# Altium schematic sheet VCSEL.SchDoc
size A4
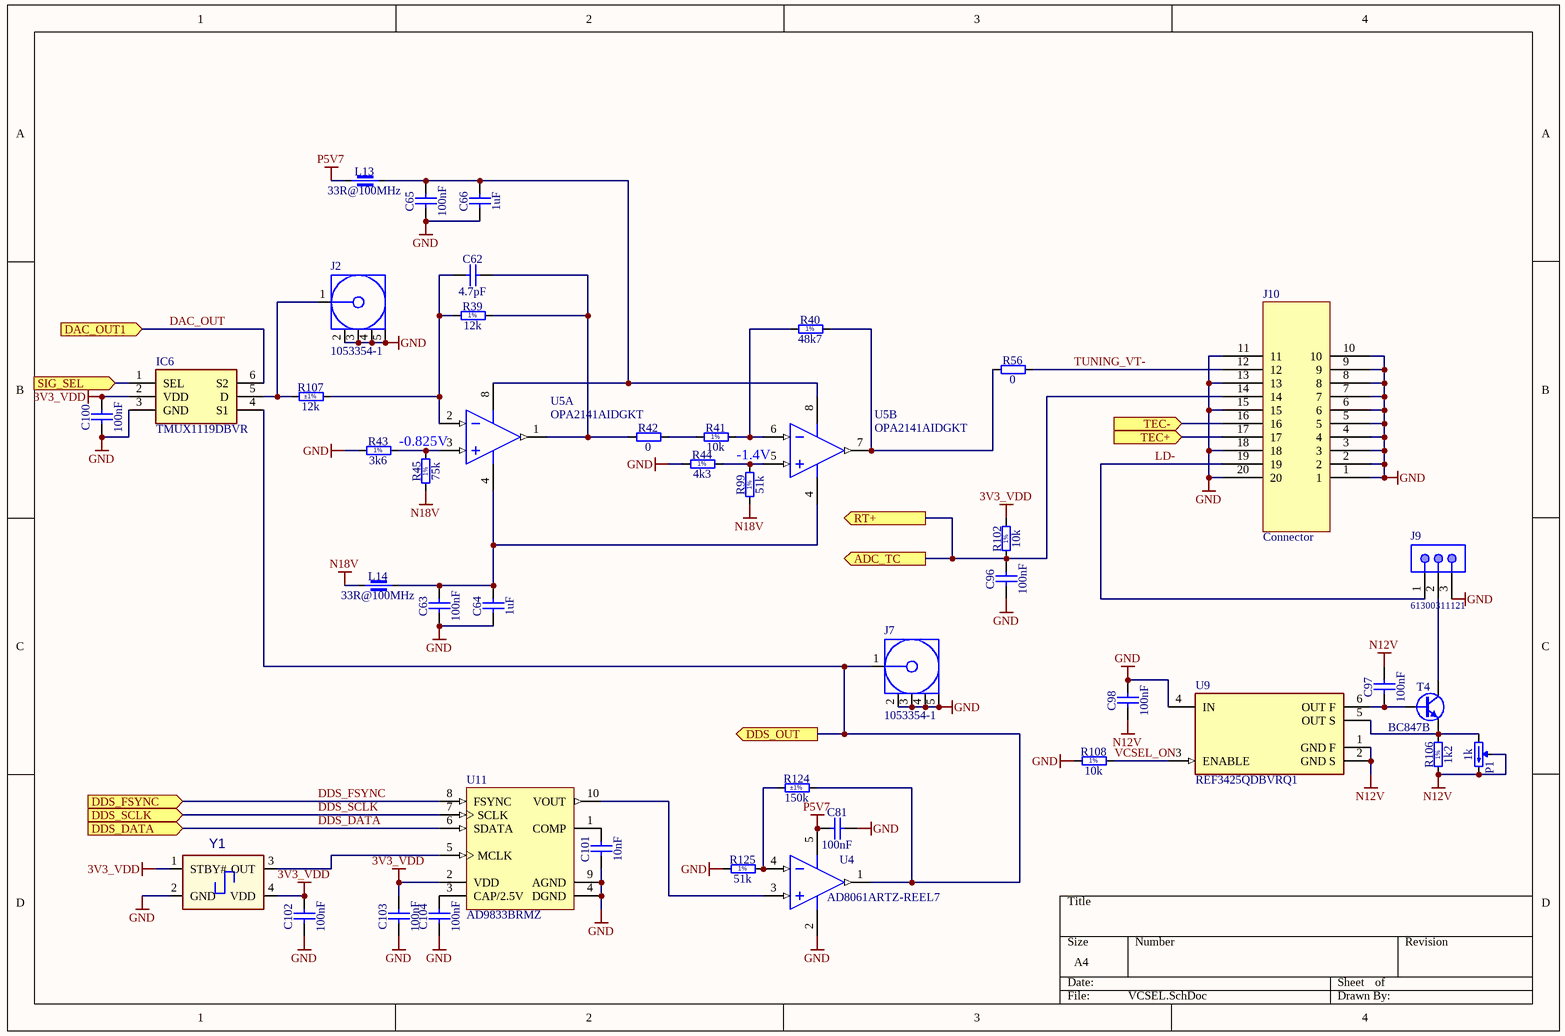
[diagram p0: VCSEL.SchDoc]

## Parts
C62  4.7pF  [CAPC1005X70N]
C63  100nF  [CAPC1608X87N]
C64  1uF  [CAPC1608X87N]
C65  100nF  [CAPC1005X55N]
C66  1uF  [CAPC1005X55N]
C81  100nF  [CAPC1005X55N]
C96  100nF  [CAPC1005X55N]
C97  100nF  [CAPC1005X55N]
C98  100nF  [CAPC1005X55N]
C100  100nF  [CAPC1005X55N]
C101  10nF  [CAPC1005X55N]
C102  100nF  [CAPC1005X55N]
C103  100nF  [CAPC1005X55N]
C104  100nF  [CAPC1005X55N]
IC6  TMUX1119DBVR  [SOT95P280X145-6N]
J2  1053354-1  [TECO-1053354-1_V]
J7  1053354-1  [TECO-1053354-1_V]
J9  61300311121  [61300311121]
J10  Connector  [VCSEL_CONNECTOR]
L13  33R@100MHz  [INDC1005X55N]
L14  33R@100MHz  [INDC1005X55N]
P1  1k  [TRIM_BOURNS_3266W]
R39  12k  [RESC1005X40N]
R40  48k7  [RESC1608X55N]
R41  10k  [RESC1005X40N]
R42  0  [RESC1005X40N]
R43  3k6  [RESC1005X40N]
R44  4k3  [RESC1005X40N]
R45  75k  [RESC1005X40N]
R56  0  [RESC1005X40N]
R99  51k  [RESC1005X40N]
R102  10k  [RESC1005X40N]
R106  1k2  [RESC1005X40N]
R107  12k  Tolerance: ±1%  [RESC1005X40N]
R108  10k  [RESC1005X40N]
R124  150k  Tolerance: ±1%  [RESC1005X40N]
R125  51k  [RESC1005X40N]
T4  BC847B  [SOT95P230X110-3N]
U4  AD8061ARTZ-REEL7  [ADI-RJ-5_L]
U5  OPA2141AIDGKT  [DGK0008A_M]  (parts A,B of 2)
U9  REF3425QDBVRQ1  [FP-DBV0006A-MFG]
U11  AD9833BRMZ  [ADI-RM-10_M]
Y1  OSCILLATOR_4P_nSTBY  [OSCILLATOR_CDFN_L2.5W2.0H0.85]  (value not drawn)

## Ports
ADC_TC (out), DAC_OUT1 (in), DDS_DATA (in), DDS_FSYNC (in), DDS_OUT (out), DDS_SCLK (in), RT+ (out), SIG_SEL (in), TEC+ (in), TEC- (in)

## Nets
3V3_VDD: C100.2 C102.2 C103.2 IC6.2(VDD) R102.2 U11.2(VDD) Y1.1(STBY#) Y1.4(VDD)
GND: C63.1 C64.1 C65.1 C66.1 C81.2 C96.1 C98.2 C100.1 C101.1 C102.1 C103.1 C104.1 IC6.3(GND) J2.2 J2.3 J2.4 J2.5 J7.2 J7.3 J7.4 J7.5 J9.3 J10.1 J10.2 J10.3 J10.4 J10.5 J10.6 J10.7 J10.8 J10.9 J10.10 J10.11 J10.13 J10.15 J10.18 J10.20 R43.1 R44.1 R108.1 R125.1 U4.2(-VS) U9.4(IN) U11.4(DGND) U11.9(AGND) Y1.2(GND)
N12V: C97.2 C98.1 P1.2(W) P1.3(CW) R106.1 U9.1(GND_F) U9.2(GND_S)
N18V: L14.1 R45.1 R99.1
P5V7: C81.1 L13.1 U4.5(+VS)
ADC_TC: C96.2 J10.14 R102.1 ; port ADC_TC, port RT+
DAC_OUT: IC6.6(S2) ; port DAC_OUT1
DDS_DATA: U11.6(SDATA) ; port DDS_DATA
DDS_FSYNC: U11.8(FSYNC) ; port DDS_FSYNC
DDS_OUT: IC6.4(S1) J7.1 R124.2 U4.1(VOUT) ; port DDS_OUT
DDS_SCLK: U11.7(SCLK) ; port DDS_SCLK
LD-: J9.1 J10.19
SIG_SEL: IC6.1(SEL) ; port SIG_SEL
TEC+: J10.17 ; port TEC+
TEC-: J10.16 ; port TEC-
TUNING_VT-: J10.12 R56.2
VCSEL_ON: R108.2 U9.3(ENABLE)
NetC62_1: C62.1 R39.1 R107.2 U5.2(IN_A-)
NetC62_2: C62.2 R39.2 R42.1 U5.1(OUT_A)
NetC63_2: C63.2 C64.2 L14.2 U5.4(V-)
NetC65_2: C65.2 C66.2 L13.2 U5.8(V+)
NetC97_1: C97.1 T4.1(B) U9.6(OUT_F)
NetC101_2: C101.2 U11.1(COMP)
NetC104_2: C104.2 U11.3(CAP/2.5V)
NetIC6_5: IC6.5(D) J2.1 R107.1
NetJ9_2: J9.2 T4.3(C)
NetP1_1: P1.1(CCW) R106.2 T4.2(E) U9.5(OUT_S)
NetR40_1: R40.1 R41.2 U5.6(IN_B-)
NetR40_2: R40.2 R56.1 U5.7(OUT_B)
NetR41_1: R41.1 R42.2
NetR43_2: R43.2 R45.2 U5.3(IN_A+)
NetR44_2: R44.2 R99.2 U5.5(IN_B+)
NetR124_1: R124.1 R125.2 U4.4(-IN)
NetU4_3: U4.3(+IN) U11.10(VOUT)
NetU11_5: U11.5(MCLK) Y1.3(OUT)

## Notes on the sheet
- -0.825V
- -1.4V
- (in symbol R0402_1K2_1%_0.0625W_100PPM) 1%
- (in symbol R0402_3K6_1%_0.0625W_100PPM) 1%
- (in symbol R0402_4K3_1%_0.0625W_100PPM) 1%
- (in symbol R0402_10K_1%_0.0625W_100PPM) 1%
- (in symbol R0402_12K_1%_0.0625W_100PPM) 1%
- (in symbol R0402_51K_1%_0.0625W_100PPM) 1%
- (in symbol R0402_75K_1%_0.0625W_100PPM) 1%
- (in symbol R0603_48K7_1%_0.1W_100PPM) 1%

## Library data of the parts
C62 = CC0402_4.7PF_50V_0.25PF_C0G_VISHAY_VJ_NON-MAGNETIC: Non-polarised capacitor; Part Description: Surface Mount Multilayer Ceramic Chip Capacitors for Non-Magnetic Applications (IR Reflow Soldering); Manufacturer: VISHAY VITRAMON; Manufacturer Part Number: VJ0402A4R7CCAA; Voltage: 50V; TC: C0G/NP0; Tolerance: ±0.25pF; Part Number: CC0402_4.7PF_50V_0.25PF_C0G_VISHAY_VJ_NON-MAGNETIC; Component Kind: Standard; Component Type: Standard; Pin Count: 2; Value: 4.7pF; Status: Not Recommended; Case: 0402; Mounted: Yes; Socket: No; SMD: Yes; Sense: No; ComponentHeight: 0.64mm; HelpURL: \\cern.ch\dfs\Applications\Altium\Datasheets\CC0402_VISHAY_VJ_NON-MAGNETIC.pdf; Author: CERN DEM MR; CreateDate: 03.03.2017; LatestRevisionDate: 03.03.2017
C63 = CC0603_100NF_50V_10%_X5R: Non-polarised capacitor; Part Description: SMD Multilayer Chip Ceramic Capacitor; Manufacturer: GENERIC; Manufacturer1 Part Number: C1608X5R1H104K080; Voltage: 50V; TC: X5R; Tolerance: ±10%; Part Number: CC0603_100NF_50V_10%_X5R; Component Kind: Standard; Component Type: Standard; Pin Count: 2; Value: 100nF; Status: None; Manufacturer Part Number: CC0603_100NF_50V_10%_X5R; Case: 0603; Mounted: Yes; Socket: No; SMD: Yes; Sense: No; Manufacturer1 Example: TDK; Manufacturer1 ComponentHeight: 0.9mm; HelpURL: \\cern.ch\dfs\Applications\Altium\Datasheets\CC0603_X5R_TDK_C.pdf; Author: CERN DEM MR; CreateDate: 08.01.2016; LatestRevisionDate: 08.01.2016
C64 = CC0603_1UF_25V_10%_X7R: Non-polarised capacitor; Part Description: SMD Multilayer Chip Ceramic Capacitor; Manufacturer: GENERIC; Manufacturer1 Part Number: GRM188R71E105KA12D; Voltage: 25V; TC: X7R; Tolerance: ±10%; Part Number: CC0603_1UF_25V_10%_X7R; Component Kind: Standard; Component Type: Standard; Pin Count: 2; Value: 1uF; Status: None; Manufacturer Part Number: CC0603_1UF_25V_10%_X7R; Case: 0603; Mounted: Yes; Socket: No; SMD: Yes; Sense: No; Manufacturer1 Example: MURATA; Manufacturer1 ComponentHeight: 0.9mm; HelpURL: \\cern.ch\dfs\Applications\Altium\Datasheets\CC0603_X7R_MURATA.pdf; Author: CERN DEM JLC; CreateDate: 18.01.2011; LatestRevisionDate: 18.01.2011
C65 C81 C96-C98 C100 C102-C104 = CC0402_100NF_16V_10%_X7R: Non-polarised capacitor; Part Description: SMD Multilayer Chip Ceramic Capacitor; Manufacturer: GENERIC; Manufacturer1 Part Number: GRM155R71C104KA88D; Voltage: 16V; TC: X7R; Tolerance: ±10%; Part Number: CC0402_100NF_16V_10%_X7R; Component Kind: Standard; Component Type: Standard; Pin Count: 2; Value: 100nF; Status: Not Recommended; Manufacturer Part Number: CC0402_100NF_16V_10%_X7R; Case: 0402; Mounted: Yes; Socket: No; SMD: Yes; Sense: No; Manufacturer1 Example: MURATA; Manufacturer1 ComponentHeight: 0.55mm; HelpURL: \\cern.ch\dfs\Applications\Altium\Datasheets\CC0402_X7R_MURATA_GRM.pdf; Author: CERN DEM JLC; CreateDate: 05.12.2013; LatestRevisionDate: 03.12.2007
C66 = CC0402_1UF_16V_10%_X5R: Non-polarised capacitor; Part Description: SMD Multilayer Chip Ceramic Capacitor; Manufacturer: GENERIC; Manufacturer1 Part Number: C1005X5R1C105KT; Voltage: 16V; TC: X5R; Tolerance: ±10%; Part Number: CC0402_1UF_16V_10%_X5R; Component Kind: Standard; Component Type: Standard; Pin Count: 2; Value: 1uF; Status: Preferred; Manufacturer Part Number: CC0402_1UF_16V_10%_X5R; Case: 0402; Mounted: Yes; Socket: No; SMD: Yes; Sense: No; Manufacturer1 Example: TDK; Manufacturer1 ComponentHeight: 0.55mm; HelpURL: \\cern.ch\dfs\Applications\Altium\Datasheets\CC0402_X5R_TDK_C.pdf; Author: CERN DEM JLC; CreateDate: 25.10.2012; LatestRevisionDate: 25.10.2012
C101 = CC0402_10NF_16V_10%_X7R: Non-polarised capacitor; Part Description: SMD Multilayer Chip Ceramic Capacitor; Manufacturer: GENERIC; Manufacturer1 Part Number: 223878715636; Voltage: 16V; TC: X7R; Tolerance: ±10%; Part Number: CC0402_10NF_16V_10%_X7R; Component Kind: Standard; Component Type: Standard; Pin Count: 2; Value: 10nF; Status: Not Recommended; Manufacturer Part Number: CC0402_10NF_16V_10%_X7R; Case: 0402; Mounted: Yes; Socket: No; SMD: Yes; Sense: No; Manufacturer1 Example: PHYCOMP; Manufacturer1 ComponentHeight: 0.55mm; HelpURL: \\cern.ch\dfs\Applications\Altium\Datasheets\CC0402_X7R_PHYCOMP.pdf; Author: CERN DEM JLC; CreateDate: 03.12.2007; LatestRevisionDate: 03.12.2007
IC6 = TMUX1119DBVR: Integrated Circuit; Manufacturer_Name: Texas Instruments; Datasheet Link: https://www.ti.com/lit/gpn/TMUX1119; Height: 1.45mm; Manufacturer_Part_Number: TMUX1119DBVR
J2 J7 = CMP-2000-05830-1: Female Coaxial Connector, Pitch 2.55 mm, Height 9.5 mm, Tail Length 3.9 mm, RoHS, Bulk; Manufacturer: TE Connectivity; Dynamic Catalog: SMA; Impedance: 50Ohm; Contact Termination: Solder; Connector Type: Jack,FemaleSockets; 3D Model: 1053354-1.pdf; Other Names: 2062000000 / A30046; Datasheet Version: Rev. B, 05/2011; Package Reference: 1053354-1; RoHS Information: 1053354-1StatementofCompliance; Series: SMA; Connector Style: SMA; Family: CoaxialConnectors(RF); Category: Connectors,Interconnects; Fastening Type: Threaded; Standard Package: 125; Mounting Type: ThroughHole; Packaging: Bulk; Datasheet URL: http://www.te.com/commerce/DocumentDelivery/DDEController?Action=srchrtrv&DocNm=1053354&DocType=Customer+Drawing&DocLang=English; Mounting Technology: ThroughHole; Manufacturer URL: http://www.te.com/; Package Description: Female Coaxial Connector, Pitch 2.55 mm, Height 9.5 mm, Tail Length 3.9 mm
J9 = 61300311121: WR-PHD Pin Header, THT, pitch 2.54mm, Single Row, Vertical, 3pin; Pin Number: 3; Gender: Male; Rated Current: 3A; Working Voltage: 250VAC; Withstanding Voltage: 500VAC; Contact Resistance: 20mOhm; ComponentLink1Description: Manufacturer; ComponentLink1URL: http://www.we-online.de; ComponentLink2Description: Datasheet; ComponentLink2URL: https://katalog.we-online.de/em/datasheet/6130xx11121.pdf; Part Number: 61300311121; Published Date: June 2019; Publisher: Wurth Elektronik; Pitch: 2.54mm; Operating Temperature: -40 to +105degC; Mounting Technology: THT; Packaging: Bag; Row Number: Single; Orientation: Vertical
J10 = VCSEL_CONNECTOR: VCSEL connector
L13 L14 = IND0402_MURATA_BLM15PX330SN1D: Part Description: SMD EMIFIL Chip Ferrite Bead; Manufacturer: MURATA; Power: 3A; Resistance: 0.022R; Tolerance: ±25%; Part Number: IND0402_MURATA_BLM15PX330SN1D; Component Kind: Standard; Component Type: Standard; Pin Count: 2; Value: 33R@100MHz; Status: None; Manufacturer Part Number: BLM15PX330SN1D; Case: 0402; Mounted: Yes; Socket: No; SMD: Yes; Sense: No; ComponentHeight: 0.55mm; HelpURL: \\cern.ch\dfs\Applications\Altium\Datasheets\IND0402_MURATA_BLM15PX.pdf; Author: CERN DEM JMW; CreateDate: 19.02.2014; LatestRevisionDate: 25.10.2018
P1 = TRIM_12T_1K_BOURNS_3266W-1-102LF: Trimming Potentiometer; Part Description: 12 Turn Trimming Potentiometer (Top Adjustment); Manufacturer: BOURNS; Power: 0.25W; TC: ±100ppm/°C; Tolerance: ±10%; PressFit: No; Part Number: TRIM_12T_1K_BOURNS_3266W-1-102LF; Component Kind: Standard; Component Type: Standard; Pin Count: 3; Value: 1k; Manufacturer Part Number: 3266W-1-102LF; Case: 3266W; Mounted: Yes; Socket: No; SMD: No; Sense: No; ComponentHeight: 7.75mm; HelpURL: \\cern.ch\dfs\Applications\Altium\Datasheets\TRIM_BOURNS_3266W.pdf; Author: CERN DEM JLC; CreateDate: 10.06.2008; LatestRevisionDate: 28.11.2012
R39 = R0402_12K_1%_0.0625W_100PPM: Resistor - 1%; Part Description: General Purpose Thick Film Chip Resistor; Manufacturer: GENERIC; Manufacturer1 Part Number: 232270671203L; TC: ±100ppm/°C; PressFit: No; Part Number: R0402_12K_1%_0.0625W_100PPM; Component Kind: Standard; Component Type: Standard; Pin Count: 2; Value: 12k; Status: Not Recommended; Power: 0.0625W; Tolerance: ±1%; Manufacturer Part Number: R0402_12K_1%_0.0625W_100PPM; Case: 0402; Mounted: Yes; Sense: No; Socket: No; SMD: Yes; Manufacturer1 Example: YAGEO PHYCOMP; Manufacturer1 ComponentHeight: 0.4mm; HelpURL: \\cern.ch\dfs\Applications\Altium\Datasheets\R0402_Phycomp_RC0402.pdf; Author: CERN DEM JLC; CreateDate: 03.12.2007; LatestRevisionDate: 17.10.2012
R40 = R0603_48K7_1%_0.1W_100PPM: Resistor - 1%; Part Description: General Purpose Thick Film Chip Resistor; Manufacturer: GENERIC; Manufacturer1 Part Number: CRCW060348K7FKEA; Power: 0.1W; TC: ±100ppm/°C; PressFit: No; Part Number: R0603_48K7_1%_0.1W_100PPM; Component Kind: Standard; Component Type: Standard; Pin Count: 2; Value: 48k7; Status: Preferred; Tolerance: ±1%; Manufacturer Part Number: R0603_48K7_1%_0.1W_100PPM; Case: 0603; Mounted: Yes; Sense: No; Socket: No; SMD: Yes; Manufacturer1 Example: VISHAY; Manufacturer1 ComponentHeight: 0.55mm; HelpURL: \\cern.ch\dfs\Applications\Altium\Datasheets\R0603_VISHAY_CRCW e3.pdf; Author: CERN DEM JLC; CreateDate: 15.07.2010; LatestRevisionDate: 11.12.2013
R41 R102 R108 = R0402_10K_1%_0.0625W_100PPM: Resistor - 1%; Part Description: General Purpose Thick Film Chip Resistor; Manufacturer: GENERIC; Manufacturer1 Part Number: 232270671003L; TC: ±100ppm/°C; PressFit: No; Part Number: R0402_10K_1%_0.0625W_100PPM; Component Kind: Standard; Component Type: Standard; Pin Count: 2; Value: 10k; Status: Not Recommended; Power: 0.0625W; Tolerance: ±1%; Manufacturer Part Number: R0402_10K_1%_0.0625W_100PPM; Case: 0402; Mounted: Yes; Sense: No; Socket: No; SMD: Yes; Manufacturer1 Example: YAGEO PHYCOMP; Manufacturer1 ComponentHeight: 0.4mm; HelpURL: \\cern.ch\dfs\Applications\Altium\Datasheets\R0402_Phycomp_RC0402.pdf; Author: CERN DEM JLC; CreateDate: 03.12.2007; LatestRevisionDate: 17.10.2012
R42 R56 = R0402_0R_JUMPER: Resistor; Part Description: 1A (0.05R Max DC Resistance) Zero Ohm Jumper; Manufacturer: GENERIC; Manufacturer1 Part Number: 232270591001L; PressFit: No; Part Number: R0402_0R_JUMPER; Component Kind: Standard; Component Type: Standard; Pin Count: 2; Value: 0; Status: Not Recommended; Manufacturer Part Number: R0402_0R_JUMPER; Case: 0402; Mounted: Yes; Sense: No; Socket: No; SMD: Yes; Manufacturer1 Example: YAGEO PHYCOMP; Manufacturer1 ComponentHeight: 0.4mm; HelpURL: \\cern.ch\dfs\Applications\Altium\Datasheets\R0402_Phycomp_RC0402.pdf; Author: CERN DEM JLC; CreateDate: 03.12.2007; LatestRevisionDate: 17.10.2012
R43 = R0402_3K6_1%_0.0625W_100PPM: Resistor - 1%; Part Description: General Purpose Thick Film Chip Resistor; Manufacturer: GENERIC; Manufacturer1 Part Number: 232270673602L; TC: ±100ppm/°C; PressFit: No; Part Number: R0402_3K6_1%_0.0625W_100PPM; Component Kind: Standard; Component Type: Standard; Pin Count: 2; Value: 3k6; Status: Not Recommended; Power: 0.0625W; Tolerance: ±1%; Manufacturer Part Number: R0402_3K6_1%_0.0625W_100PPM; Case: 0402; Mounted: Yes; Sense: No; Socket: No; SMD: Yes; Manufacturer1 Example: YAGEO PHYCOMP; Manufacturer1 ComponentHeight: 0.4mm; HelpURL: \\cern.ch\dfs\Applications\Altium\Datasheets\R0402_Phycomp_RC0402.pdf; Author: CERN DEM JLC; CreateDate: 03.12.2007; LatestRevisionDate: 17.10.2012
R44 = R0402_4K3_1%_0.0625W_100PPM: Resistor - 1%; Part Description: General Purpose Thick Film Chip Resistor; Manufacturer: GENERIC; Manufacturer1 Part Number: 232270674302L; TC: ±100ppm/°C; PressFit: No; Part Number: R0402_4K3_1%_0.0625W_100PPM; Component Kind: Standard; Component Type: Standard; Pin Count: 2; Value: 4k3; Status: Not Recommended; Power: 0.0625W; Tolerance: ±1%; Manufacturer Part Number: R0402_4K3_1%_0.0625W_100PPM; Case: 0402; Mounted: Yes; Sense: No; Socket: No; SMD: Yes; Manufacturer1 Example: YAGEO PHYCOMP; Manufacturer1 ComponentHeight: 0.4mm; HelpURL: \\cern.ch\dfs\Applications\Altium\Datasheets\R0402_Phycomp_RC0402.pdf; Author: CERN DEM JLC; CreateDate: 03.12.2007; LatestRevisionDate: 17.10.2012
R45 = R0402_75K_1%_0.0625W_100PPM: Resistor - 1%; Part Description: General Purpose Thick Film Chip Resistor; Manufacturer: GENERIC; Manufacturer1 Part Number: 232270677503L; TC: ±100ppm/°C; PressFit: No; Part Number: R0402_75K_1%_0.0625W_100PPM; Component Kind: Standard; Component Type: Standard; Pin Count: 2; Value: 75k; Status: Not Recommended; Power: 0.0625W; Tolerance: ±1%; Manufacturer Part Number: R0402_75K_1%_0.0625W_100PPM; Case: 0402; Mounted: Yes; Sense: No; Socket: No; SMD: Yes; Manufacturer1 Example: YAGEO PHYCOMP; Manufacturer1 ComponentHeight: 0.4mm; HelpURL: \\cern.ch\dfs\Applications\Altium\Datasheets\R0402_Phycomp_RC0402.pdf; Author: CERN DEM JLC; CreateDate: 03.12.2007; LatestRevisionDate: 17.10.2012
R99 R125 = R0402_51K_1%_0.0625W_100PPM: Resistor - 1%; Part Description: General Purpose Thick Film Chip Resistor; Manufacturer: GENERIC; Manufacturer1 Part Number: 232270674703L; TC: ±100ppm/°C; PressFit: No; Part Number: R0402_51K_1%_0.0625W_100PPM; Component Kind: Standard; Component Type: Standard; Pin Count: 2; Value: 51k; Status: Not Recommended; Power: 0.0625W; Tolerance: ±1%; Manufacturer Part Number: R0402_51K_1%_0.0625W_100PPM; Case: 0402; Mounted: Yes; Sense: No; Socket: No; SMD: Yes; Manufacturer1 Example: YAGEO PHYCOMP; Manufacturer1 ComponentHeight: 0.4mm; HelpURL: \\cern.ch\dfs\Applications\Altium\Datasheets\R0402_Phycomp_RC0402.pdf; Author: CERN DEM JLC; CreateDate: 03.12.2007; LatestRevisionDate: 17.10.2012
R106 = R0402_1K2_1%_0.0625W_100PPM: Resistor - 1%; Part Description: General Purpose Thick Film Chip Resistor; Manufacturer: GENERIC; Manufacturer1 Part Number: 232270671202L; TC: ±100ppm/°C; PressFit: No; Part Number: R0402_1K2_1%_0.0625W_100PPM; Component Kind: Standard; Component Type: Standard; Pin Count: 2; Value: 1k2; Status: Not Recommended; Power: 0.0625W; Tolerance: ±1%; Manufacturer Part Number: R0402_1K2_1%_0.0625W_100PPM; Case: 0402; Mounted: Yes; Sense: No; Socket: No; SMD: Yes; Manufacturer1 Example: YAGEO PHYCOMP; Manufacturer1 ComponentHeight: 0.4mm; HelpURL: \\cern.ch\dfs\Applications\Altium\Datasheets\R0402_Phycomp_RC0402.pdf; Author: CERN DEM JLC; CreateDate: 03.12.2007; LatestRevisionDate: 17.10.2012
R107 = R0402_12K_1%_0.0625W_100PPM: Resistor - 1%; Part Description: General Purpose Thick Film Chip Resistor; Manufacturer: GENERIC; Manufacturer1 Part Number: 232270671203L; PressFit: No; TC: ±100ppm/°C; Part Number: R0402_12K_1%_0.0625W_100PPM; Component Kind: Standard; Component Type: Standard; Pin Count: 2; Value: 12k; Status: Not Recommended; Manufacturer Part Number: R0402_12K_1%_0.0625W_100PPM; Case: 0402; Mounted: Yes; Sense: No; Socket: No; SMD: Yes; Manufacturer1 Example: YAGEO PHYCOMP; Manufacturer1 ComponentHeight: 0.4mm; HelpURL: \\cern.ch\dfs\Applications\Altium\Datasheets\R0402_Phycomp_RC0402.pdf; Author: CERN DEM JLC; CreateDate: 03.12.2007; LatestRevisionDate: 17.10.2012; Power: 0.0625W
R124 = R0402_150K_1%_0.0625W_100PPM: Resistor - 1%; Part Description: General Purpose Thick Film Chip Resistor; Manufacturer: GENERIC; Manufacturer1 Part Number: 232270671504L; TC: ±100ppm/°C; PressFit: No; Part Number: R0402_150K_1%_0.0625W_100PPM; Component Kind: Standard; Component Type: Standard; Pin Count: 2; Value: 150k; Status: Not Recommended; Power: 0.0625W; Manufacturer Part Number: R0402_150K_1%_0.0625W_100PPM; Case: 0402; Mounted: Yes; Sense: No; Socket: No; SMD: Yes; Manufacturer1 Example: YAGEO PHYCOMP; Manufacturer1 ComponentHeight: 0.4mm; HelpURL: \\cern.ch\dfs\Applications\Altium\Datasheets\R0402_Phycomp_RC0402.pdf; Author: CERN DEM JLC; CreateDate: 03.12.2007; LatestRevisionDate: 17.10.2012
T4 = BC847B: NPN Transistor; Part Description: 45V 100mA NPN general-purpose transistors; Manufacturer: NXP SEMICONDUCTORS; PressFit: No; Bonding: No; Part Number: BC847B; Component Kind: Standard; Component Type: Standard; Device: BC847B; PackageDescription: SOT23, 0.95mm Pitch; 3 Pin, 1.30mm W X 2.90mm L X 1.10mm H body, IPC Medium Density; Manufacturer Part Number: BC847B; Pin Count: 3; Case: SOT23-3; Mounted: Yes; Socket: No; SMD: Yes; Sense: No; ComponentHeight: 1.1mm; HelpURL: \\cern.ch\dfs\Applications\Altium\Datasheets\BC847B.pdf; Author: CERN DEM JLC; CreateDate: 14.06.2011; LatestRevisionDate: 14.06.2011
U4 = CMP-0384-01491-2: Single Channel Low Offset Voltage Operational Amplifier, 320 MHz BW, 650 V/us SR, Industrial, 5-pin SOT23 (RJ-5), Reel; Generic Part Number: AD8061; Manufacturer: Analog Devices; Iq/Amp: 9.5mA; V Span Min: 2.7V; Input Offset Voltage: 1mV; Input Bias Current: 350nA; Small Signal Bandwidth: 320MHz; Amplifiers Per Package: 1; V Span Max: 8V; PartNumber: AD8061ARTZ-REEL7; ComponentLink3Description: Package Specification; PackageReference: RJ-5; PackageVersion: 121608-A; RevisionNote: Symbol corrected, Pin 2 orientation reversed; ComponentLink1URL: http://www.analog.com/en/index.html; ComponentLink1Description: Manufacturer URL; ComponentLink2URL: http://www.analog.com/static/imported-files/data_sheets/AD8061_8062_8063.pdf; ComponentLink2Description: Datasheet; Code_JEDEC: MO-178-AA; Slew Rate: 650V/us; DatasheetVersion: Rev. G; PackageDescription: 5-Pin Small Outline Transistor Package, Body 2.9 x 1.6 mm, Pitch 0.95 mm; ComponentLink3URL: http://www.analog.com/static/imported-files/packages/PKG_PDF/SOT-23(RJ)/RJ_5.pdf; Mounting Technology: Surface Mount
U5 = CMP-0272-01226-3: 10 MHz, Single Supply, Low Noise, JFET Precision Amplifier, 4.5 to 36 V, -40 to 125 degC, 8-pin SOP (DGK8), Green (RoHS & no Sb/Br); Manufacturer: Texas Instruments; CMRR(Min)(dB): 120; IIB(Max)(pA): 20; Number of Channels: 2; Rating: Catalog; Packing: SMALL T&R; Total Supply Voltage(Max)(+5V is 5, +/-5V is 10): 36; Iq per channel(Max)(mA): 2.3; Vio (25C)(Max)(mV): 3.5; Total Supply Voltage(Min)(+5V is 5, +/-5V is 10): 4.5; Sub Family: High Supply Voltage Amplifier (>=30V), Low Noise Amp (<=10nV/rtHz), Precision Amplifier; GBW(Typ)(MHz): 10; Eco-Plan: Green (RoHS & no Sb/Br); ComponentLink1Description: Manufacturer URL; ComponentLink1URL: http://www.ti.com/; Slew Rate(Typ)(V/us): 20; PackageDescription: 8-Pin Thin Small Outline, Body 3 x 3 mm, Pitch 0.65 mm; DatasheetVersion: SBOS510B; ComponentLink2Description: Datasheet; ComponentLink3URL: http://www.ti.com/litv/pdf/mpds028d; ComponentLink3Description: Package Specification; PackageReference: DGK0008A; PackageVersion: 4073329/E, 05/2006; PartNumber: OPA2141AIDGKT; Mounting Technology: Surface Mount; Code_JEDEC: MO-187; ComponentLink2URL: http://www.ti.com/lit/ds/symlink/opa2141.pdf; Offset Drift(Typ)(uV/C): 2
U9 = CMP-04916-000005-1: IC VREF SERIES 0.05% SOT23-6; Manufacturer: Texas Instruments; Output Voltage: 2.5V; Max Supply Voltage: 12V; Output Type: Fixed; Automotive Grade: Grade 1; Number Of Outputs: 1; Output Current: 10mA; Nominal Supply Current: 72uA; Standoff Height: 0mm; Temperature: -40°C to +125°C; Temperature Range Low: -40°C; ComponentLink2Description: Datasheet; Manufacturer Part Number: REF3425QDBVRQ1; Device Class L2: Power Management ICs; RoHS: TRUE; Temperature Range High: +125°C; Digikey Description: IC VREF SERIES 0.05% SOT23-6; Octopart: https://octopart.com/ref3433qdbvrq1-texas+instruments-95842010; ComponentLink2URL: https://www.ti.com/lit/ds/symlink/ref34-q1.pdf; Mouser Description: Automotive low-drift low-power small-footprint series voltage reference 6-SOT-23 -40 to 125; Package: DBV0006A; Ambient Temperature Range High: +125°C; Device Class L1: Integrated Circuits (ICs); Device Class L3: Voltage References; Category: IC; Height: 1.45mm; Lead Free: Yes; Automotive: Yes; Reference Type: Series; Ambient Temperature Range Low: -40°C
U11 = CMP-0293-00077-1: Low Power, 12.65 mW, 2.3 V to 5.5 V, Programmable Waveform Generator, 10-Bit, Serial, RM-10, 50 Tube, Pb-Free; Resolution (Bits): 10bit; Compliance Range (V): 650mV; FS Iout (mA nom): 3mA; REFCLK Multiplier: No; Master fclk: 25MHz; I Supply total (max): 5.5mA; Tuning Word Width (bits): 28bit; Code_JEDEC: MO-187-BA; DatasheetVersion: Rev. D; PackageVersion: 5/8/2005; ComponentLink1URL: www.analog.com; ComponentLink3Description: Package Specification; PackageDescription: 10-Lead Mini Small Outline Package [MSOP]; I/O Interface: Serial; ComponentLink2Description: Datasheet; ComponentLink1Description: Manufacturer URL; PackageReference: RM-10; ComponentLink2URL: http://www.analog.com/static/imported-files/data_sheets/AD9833.pdf; ComponentLink3URL: http://www.analog.com/static/imported-files/packages/PKG_PDF/MSOP%28RM%29/RM_10.pdf
Y1 = MIC8253: Manufacturer 1: Microchip Technology; Manufacturer Part Number 1: DSC1001CI2-025.0000; Description_: MCHP CLOCK OSCILLATOR SINGLE 25MHZ DSC1001CI2-025.0000 CDFN-4; Dev Tools Status: Production; Value: 25MHz; Owner: Sam Charles; Populated: YES; Revision: 1; MCHP-ID: MIC8253; Symbol: OSCILLATOR_4P_nSTBY; Status: MCL Design; ComponentLink1URL: https://chn-vm-apps.microchip.com/mchprepo/parts/Datasheets/20005529B.pdf; ComponentLink1Description: SVN Datasheet; ComponentLink2URL: C:\ALTIUM_WORK\00001_MCHP-CDB\Datasheets\20005529B.pdf; ComponentLink2Description: Local Datasheet; ComponentLink3URL: C:\ALTIUM_WORK\00001_MCHP-CDB\Library\LibraryRefs\OSCILLATOR_4P_nSTBY.SchLib; ComponentLink3Description: Open Symbol; ComponentLink4URL: C:\ALTIUM_WORK\00001_MCHP-CDB\Library\Footprints\OSCILLATOR_CDFN_L2.5W2.0H0.85.PcbLib; ComponentLink4Description: Open Footprint; ComponentLink5Description: Open Footprint 2; ComponentLink6Description: Open Footprint 3; ComponentLink7Description: Open Footprint 4; Category: MCHP-Clock/Timing; Type: Oscillator; Supplier 1: Digi-Key; Supplier Part Number 1: DSC1001CI2-025.0000CT-ND; Quantity Override: 1